# Altium schematic sheet sch6.SchDoc
size 420 x 297 mm; Address1: Address1; Address2: Address2; Address3: Address3; Address4: Address4; DocumentNumber: АБВГ.123456.001 Э3; SheetNumber: 1; Scale: 1:1; DocumentType: Схема электрическая принципиальная; FirstReferrence: АБВГ.123456.001
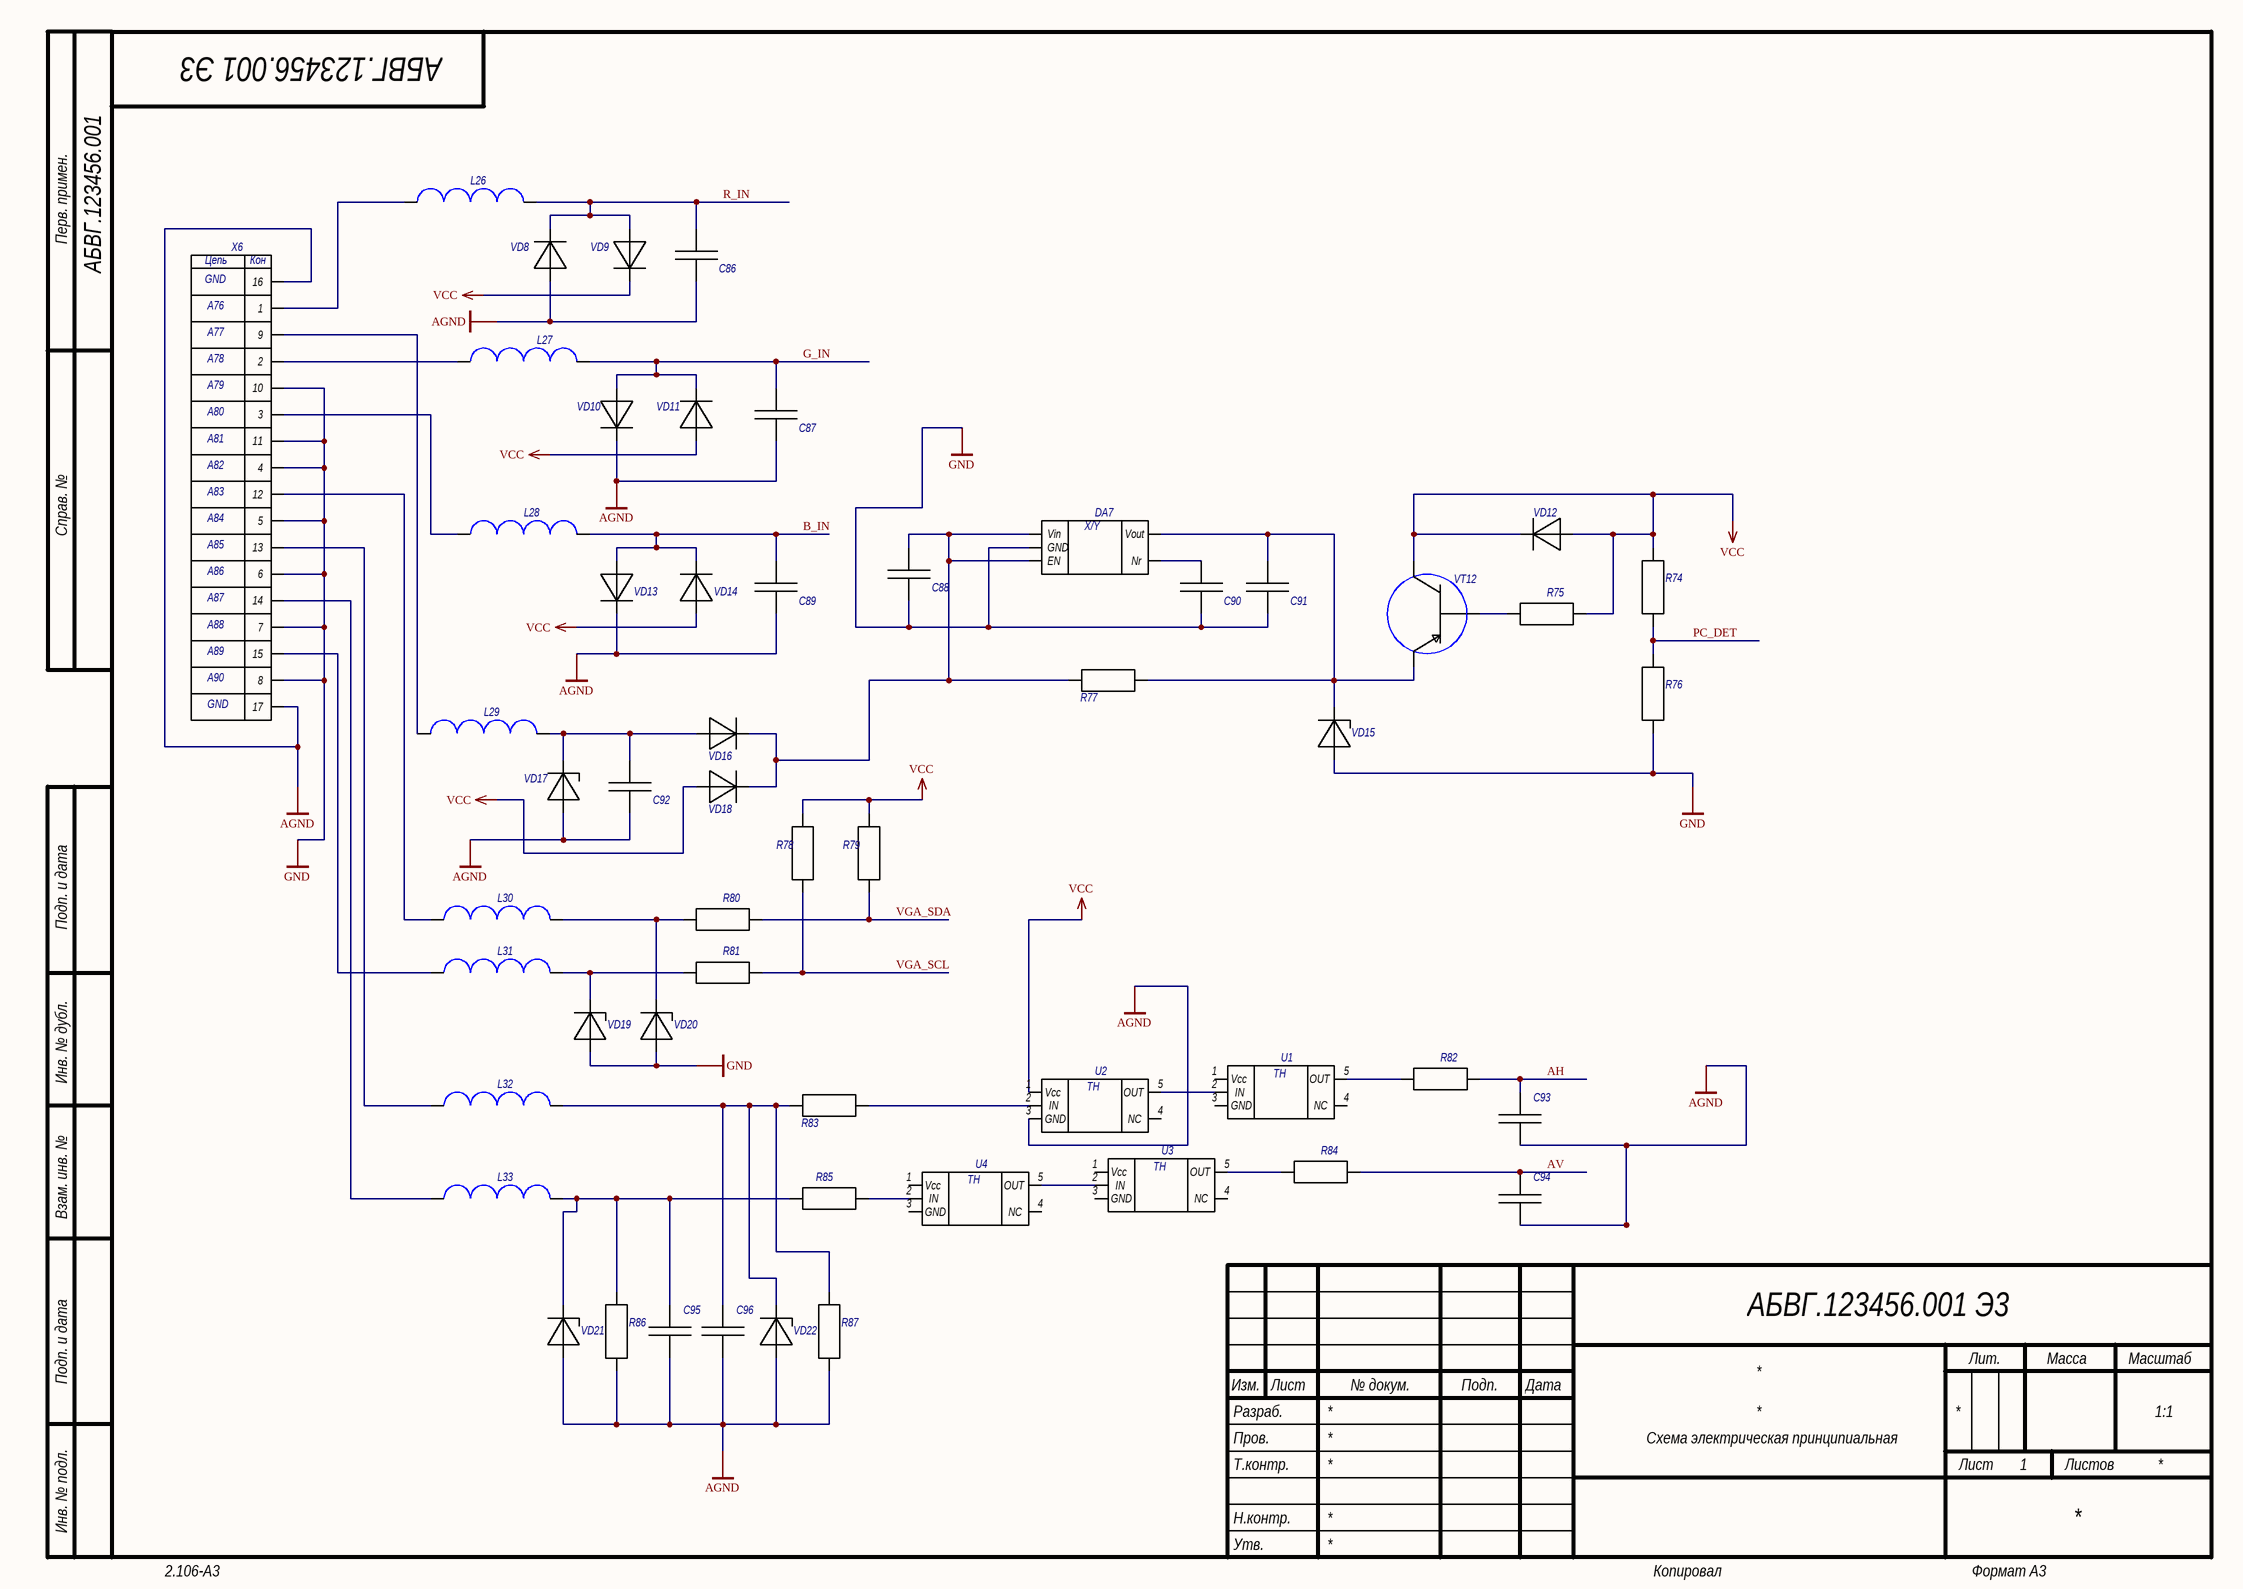
[diagram p0: sch6.SchDoc]

## Parts
C86  *  [Capacitor 0805]  (value not drawn)
C87  *  [Capacitor 0805]  (value not drawn)
C88  *  [Capacitor 0805]  (value not drawn)
C89  *  [Capacitor 0805]  (value not drawn)
C90  *  [Capacitor 0805]  (value not drawn)
C91  *  [Capacitor 0805]  (value not drawn)
C92  *  [Capacitor 0805]  (value not drawn)
C93  *  [Capacitor 0805]  (value not drawn)
C94  *  [Capacitor 0805]  (value not drawn)
C95  *  [Capacitor 0805]  (value not drawn)
C96  *  [Capacitor 0805]  (value not drawn)
DA7  *  [MIC5205]  (value not drawn)
L26  *  [Inductor 2520]  (value not drawn)
L27  *  [Inductor 2520]  (value not drawn)
L28  *  [Inductor 2520]  (value not drawn)
L29  *  [Inductor 2520]  (value not drawn)
L30  *  [Inductor 2520]  (value not drawn)
L31  *  [Inductor 2520]  (value not drawn)
L32  *  [Inductor 2520]  (value not drawn)
L33  *  [Inductor 2520]  (value not drawn)
R74  *  [Resistor 1206]  (value not drawn)
R75  *  [Resistor 1206]  (value not drawn)
R76  *  [Resistor 1206]  (value not drawn)
R77  *  [Resistor 1206]  (value not drawn)
R78  *  [Resistor 1206]  (value not drawn)
R79  *  [Resistor 1206]  (value not drawn)
R80  *  [Resistor 1206]  (value not drawn)
R81  *  [Resistor 1206]  (value not drawn)
R82  *  [Resistor 1206]  (value not drawn)
R83  *  [Resistor 1206]  (value not drawn)
R84  *  [Resistor 1206]  (value not drawn)
R85  *  [Resistor 1206]  (value not drawn)
R86  *  [Resistor 1206]  (value not drawn)
R87  *  [Resistor 1206]  (value not drawn)
U1  *  [MIC5205]  (value not drawn)
U2  *  [MIC5205]  (value not drawn)
U3  *  [MIC5205]  (value not drawn)
U4  *  [MIC5205]  (value not drawn)
VD8  *  [Diode]  (value not drawn)
VD9  *  [Diode]  (value not drawn)
VD10  *  [Diode]  (value not drawn)
VD11  *  [Diode]  (value not drawn)
VD12  *  [Diode]  (value not drawn)
VD13  *  [Diode]  (value not drawn)
VD14  *  [Diode]  (value not drawn)
VD15  *  [Diode]  (value not drawn)
VD16  *  [Diode]  (value not drawn)
VD17  *  [Diode]  (value not drawn)
VD18  *  [Diode]  (value not drawn)
VD19  *  [Diode]  (value not drawn)
VD20  *  [Diode]  (value not drawn)
VD21  *  [Diode]  (value not drawn)
VD22  *  [Diode]  (value not drawn)
VT12  *  [Transistor 1]  (value not drawn)
X6  *  [VGA Connector]  (value not drawn)

## Nets
AGND: C86.1 C87.1 C89.1 C92.1 C93.1 C94.1 C95.1 C96.1 R86.1 R87.1 U2.3(GND) VD8.1 VD10.2 VD13.2 VD17.1 VD21.1 VD22.1 X6.16 X6.17
GND: C88.1 C90.1 C91.1 DA7.2(GND) R76.1 VD15.1 VD19.1 VD20.1 X6.4 X6.5 X6.6 X6.7 X6.8 X6.10 X6.11
VCC: R74.2 R75.2 R78.2 R79.2 U2.1(Vcc) VD9.2 VD11.1 VD12.1 VD12.2 VD14.1 VD18.1 VT12.1(KOLLECTOR)
AH: C93.2 R82.2
AV: C94.2 R84.2
B_IN: C89.2 L28.2 VD13.1 VD14.2
G_IN: C87.2 L27.2 VD10.1 VD11.2
PC_DET: R74.1 R76.2
R_IN: C86.2 L26.2 VD8.2 VD9.1
VGA_SCL: R78.1 R81.2
VGA_SDA: R79.1 R80.2
NetC88_2: C88.2 DA7.1(Vin) DA7.3(EN) R77.1 VD16.2 VD18.2
NetC90_2: C90.2 DA7.4(Nr)
NetC91_2: C91.2 DA7.5(Vout) R77.2 VD15.2 VT12.2(EMITTER)
NetC92_2: C92.2 L29.2 VD16.1 VD17.2
NetC95_2: C95.2 L33.2 R85.1 R86.2 VD21.2
NetC96_2: C96.2 L32.2 R83.1 R87.2 VD22.2
NetL26_1: L26.1 X6.1
NetL27_1: L27.1 X6.2
NetL28_1: L28.1 X6.3
NetL29_1: L29.1 X6.9
NetL30_1: L30.1 X6.12
NetL30_2: L30.2 R80.1 VD20.2
NetL31_1: L31.1 X6.15
NetL31_2: L31.2 R81.1 VD19.2
NetL32_1: L32.1 X6.13
NetL33_1: L33.1 X6.14
NetR75_1: R75.1 VT12.3(BAZA)
NetR82_1: R82.1 U1.5(OUT)
NetR83_2: R83.2 U2.2(IN)
NetR84_1: R84.1 U3.5(OUT)
NetR85_2: R85.2 U4.2(IN)
NetU1_2: U1.2(IN) U2.5(OUT)
NetU3_2: U3.2(IN) U4.5(OUT)

Not connected (* = marked no-connect by the designer): U1 1(Vcc) 3(GND) 4(NC); U2 4(NC); U3 1(Vcc) 3(GND) 4(NC); U4 1(Vcc) 3(GND) 4(NC)

## Notes on the sheet
- Перв. примен.
- Справ. №
- Подп. и дата
- Инв. № дубл.
- Взам. инв. №
- Разраб.
- Изм.
- Лист
- № докум.
- Подп.
- Дата
- Лит.
- Масса
- Масштаб
- Пров.
- Т.контр.
- Листов
- Инв. № подл.
- Утв.
- Н.контр.
- 2.106-A3
- Копировал
- Формат А3
- (in symbol MIC52) X/Y
- (in symbol Schmitt Inv) TH
- (in symbol VGA connector) Цепь; Кон; GND; A76; A77; A78; A79; A80; A81; A82; A83; A84; A85; A86; A87; A88; A89; A90

## Library data of the parts
C86-C96 = Capacitor: Model: *
DA7 = MIC52
L26-L33 = Inductor: Model: *
R74-R87 = Resistor: Model: *
U1-U4 = Schmitt Inv
VD8-VD14 VD16 VD18 = Diode 1: Model: *
VD15 VD17 VD19-VD22 = Diode 2: Model: *
VT12 = Transistor 2
X6 = VGA connector